# EAGLE design 10leds (EAGLE 6.4)
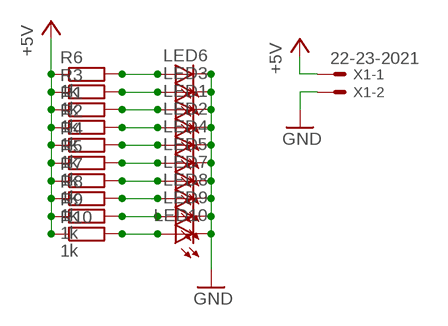
[diagram p0: schematic, sheet 1]

## Parts
LED1  LED3MM  [LED3MM]
LED2  LED3MM  [LED3MM]
LED3  LED3MM  [LED3MM]
LED4  LED3MM  [LED3MM]
LED5  LED3MM  [LED3MM]
LED6  LED3MM  [LED3MM]
LED7  LED3MM  [LED3MM]
LED8  LED3MM  [LED3MM]
LED9  LED3MM  [LED3MM]
LED10  LED3MM  [LED3MM]
R1  1k  R-EU_M1206  [M1206]
R2  1k  R-EU_M1206  [M1206]
R3  1k  R-EU_M1206  [M1206]
R4  1k  R-EU_M1206  [M1206]
R5  1k  R-EU_M1206  [M1206]
R6  1k  R-EU_M1206  [M1206]
R7  1k  R-EU_M1206  [M1206]
R8  1k  R-EU_M1206  [M1206]
R9  1k  R-EU_M1206  [M1206]
R10  1k  R-EU_M1206  [M1206]
X1  22-23-2021  [22-23-2021]

## Nets
+5V: R1.1 R2.1 R3.1 R4.1 R5.1 R6.1 R7.1 R8.1 R9.1 R10.1 X1.1
GND [power]: LED1.K(C) LED2.K(C) LED3.K(C) LED4.K(C) LED5.K(C) LED6.K(C) LED7.K(C) LED8.K(C) LED9.K(C) LED10.K(C) X1.2
N$1: LED1.A R1.2
N$2: LED2.A R2.2
N$3: LED4.A R4.2
N$4: LED5.A R5.2
N$5: LED7.A R7.2
N$6: LED8.A R8.2
N$7: LED9.A R9.2
N$8: LED10.A R10.2
N$16: LED3.A R3.2
N$23: LED6.A R6.2

## Library data of the parts
LED1-LED10 = lpatiny:LED3MM
R1-R10 = resistor:R-EU_: RESISTOR, European symbol
X1 = con-molex:22-23-2021: .100" (2.54mm) Center Header - 2 Pin; MF: MOLEX; MPN: 22-23-2021; OC_FARNELL: 1462926; OC_NEWARK: 25C3832

## Net classes
0 default: width 0.457 mm
1 power: width 0.457 mm
2 i2c: width 0.457 mm
3 fine: width 0.305 mm

## Board
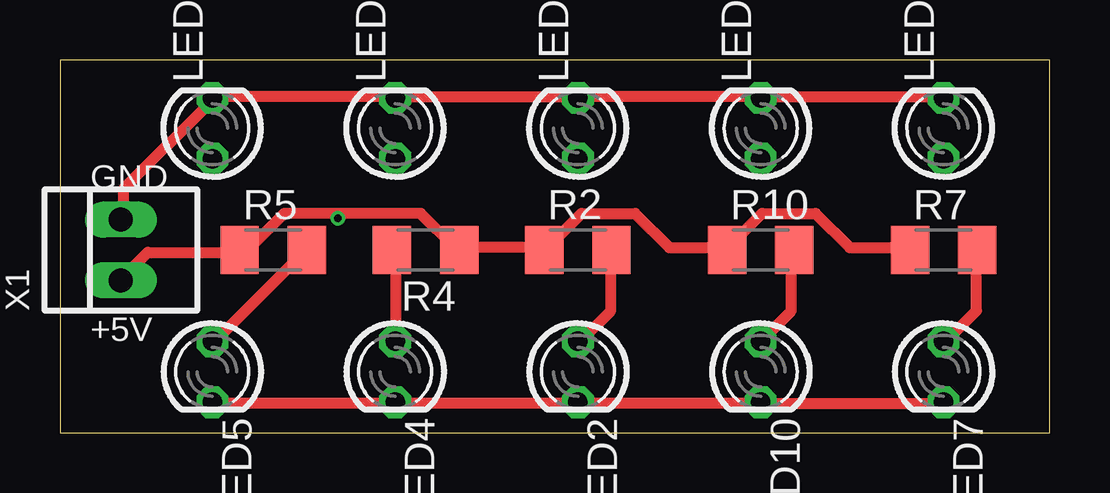
[diagram p1: board, top side]
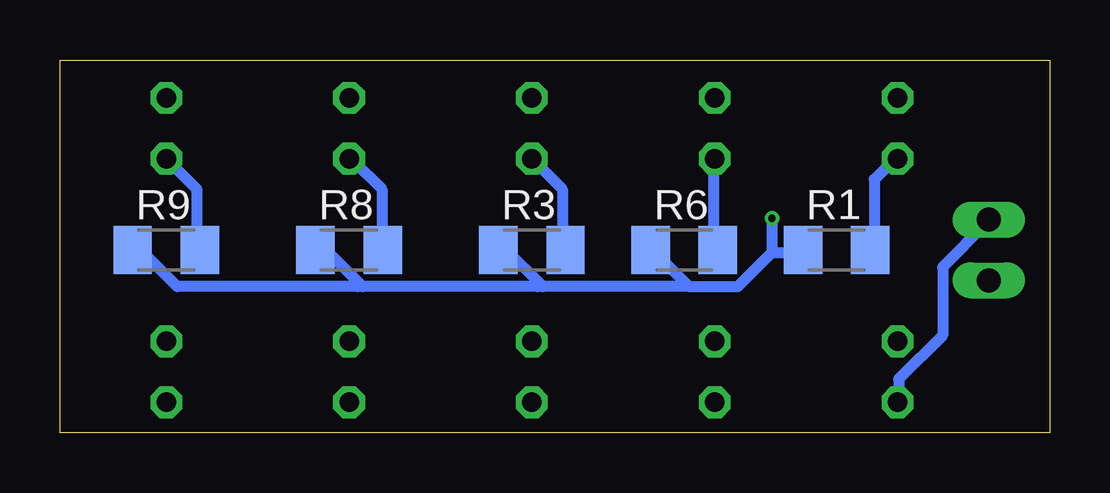
[diagram p2: board, bottom side, seen from below]

Size 41.26 x 15.55 mm. Coordinates in mm from the lower left corner, seen from the top.
Outline: 0,0 41.26,0 41.26,15.55 0,15.55 0,0
Copper layers (1*16): Top 0.035mm / dielectric 1.5mm / Bottom 0.035mm
Design rules "Fusion_eagle_rule_v1.1": minimum track width 6mil, minimum drill 12mil, track to track 6mil, track to pad 6mil, pad to pad 6mil, via to via 6mil, smd to smd 0mil, copper to edge 10mil, drill to drill 10mil, minimum pad ring 10mil, minimum via ring 6mil, stop-mask expansion 2mil, vias tented up to drill 100mil, thermal gap 10mil

### Footprints (pad centres in the part's own frame; a part is rotated, then mirrored left to right if it is on the bottom)
LED3MM = drill 0.813 octagon: A -1.27,0; K 1.27,0
M1206 = smd 1.6 x 2: 1 -1.4,0; 2 1.4,0
22-23-2021 = drill 1 long: 1 -1.27,0; 2 1.27,0

### Placement (x,y rotation side)
LED1  6.35,12.7 90 top
LED2  21.59,2.54 270 top
LED3  21.59,12.7 90 top
LED4  13.97,2.54 270 top
LED5  6.35,2.54 270 top
LED6  13.97,12.7 90 top
LED7  36.83,2.54 270 top
LED8  29.21,12.7 90 top
LED9  36.83,12.7 90 top
LED10  29.21,2.54 270 top
R1  8.89,7.62 0 bottom
R2  21.59,7.62 0 top
R3  21.59,7.62 0 bottom
R4  15.24,7.62 180 top
R5  8.89,7.62 0 top
R6  15.24,7.62 0 bottom
R7  36.83,7.62 0 top
R8  29.21,7.62 0 bottom
R9  36.83,7.62 0 bottom
R10  29.21,7.62 0 top
X1  2.54,7.62 90 top

### Tracks (layer width: path | path; a pad name or v marks a point on that pad's centre or on a via)
+5V  (via drill 0.3)
  Top 0.457: X1.1 2.64,6.5 3.66,7.52 7.32,7.52 R5.1 7.52,7.72 7.92,7.72 9.35,9.14 11.58,9.14 | R7.1 35.36,7.72 32.92,7.72 31.5,9.14 29.26,9.14 27.84,7.72 R10.1 27.64,7.72 25.4,7.72 23.98,9.14 21.74,9.14 20.32,7.72 R2.1 20.12,7.72 16.66,7.72 R4.1 16.46,7.72 15.04,9.14 11.58,9.14 | v11.58,8.94 11.58,9.14
  Bottom 0.457: 11.58,7.52 10.36,7.52 R1.1 | 11.58,7.52 13.01,6.1 15.04,6.1 | 15.04,6.1 16.46,7.52 R4.1 | 21.23,6.2 21.13,6.1 15.04,6.1 | 21.23,6.2 22.55,7.52 22.96,7.52 R3.1 | 28.75,6.2 28.65,6.1 21.34,6.1 21.23,6.2 | 28.75,6.2 30.07,7.52 30.48,7.52 R8.1 | R9.1 38.2,7.52 37.8,7.52 36.37,6.1 28.85,6.1 28.75,6.2 | v11.58,8.94 11.58,7.52
GND
  Top 0.457: LED5.K 6.5,1.22 13.82,1.22 LED4.K 14.02,1.22 21.54,1.22 LED2.K 21.74,1.22 29.06,1.22 LED10.K 29.26,1.22 36.78,1.22 LED7.K | LED9.K 36.78,14.02 29.26,14.02 LED8.K 29.06,14.02 21.74,14.02 LED3.K 21.54,14.02 14.02,14.02 LED6.K 13.82,14.02 6.5,14.02 LED1.K 6.3,13.82 2.64,10.16 2.64,8.94 X1.2
  Bottom 0.457: LED5.K 6.3,1.42 6.3,2.23 4.47,4.06 4.47,6.91 2.64,8.74 X1.2
N$1
  Bottom 0.457: R1.2 7.32,7.72 7.32,10.57 6.5,11.38 LED1.A
N$2
  Top 0.457: R2.2 22.96,7.52 22.96,5.08 21.74,3.86 LED2.A
N$3
  Top 0.457: R4.2 14.02,7.52 14.02,3.86 LED4.A
N$4
  Top 0.457: R5.2 10.16,7.52 6.5,3.86 LED5.A
N$5
  Top 0.457: R7.2 38.2,7.52 38.2,5.08 36.98,3.86 LED7.A
N$6
  Bottom 0.457: R8.2 27.84,7.72 27.84,10.16 29.06,11.38 LED8.A
N$7
  Bottom 0.457: LED9.A 35.56,10.16 35.56,7.72 R9.2
N$8
  Top 0.457: LED10.A 30.48,5.08 30.48,7.52 R10.2
N$16
  Bottom 0.457: LED3.A 20.32,10.16 20.32,7.72 R3.2
N$23
  Bottom 0.457: R6.2 14.02,7.72 14.02,11.38 LED6.A

### Text on the board
tNames: GND | +5V